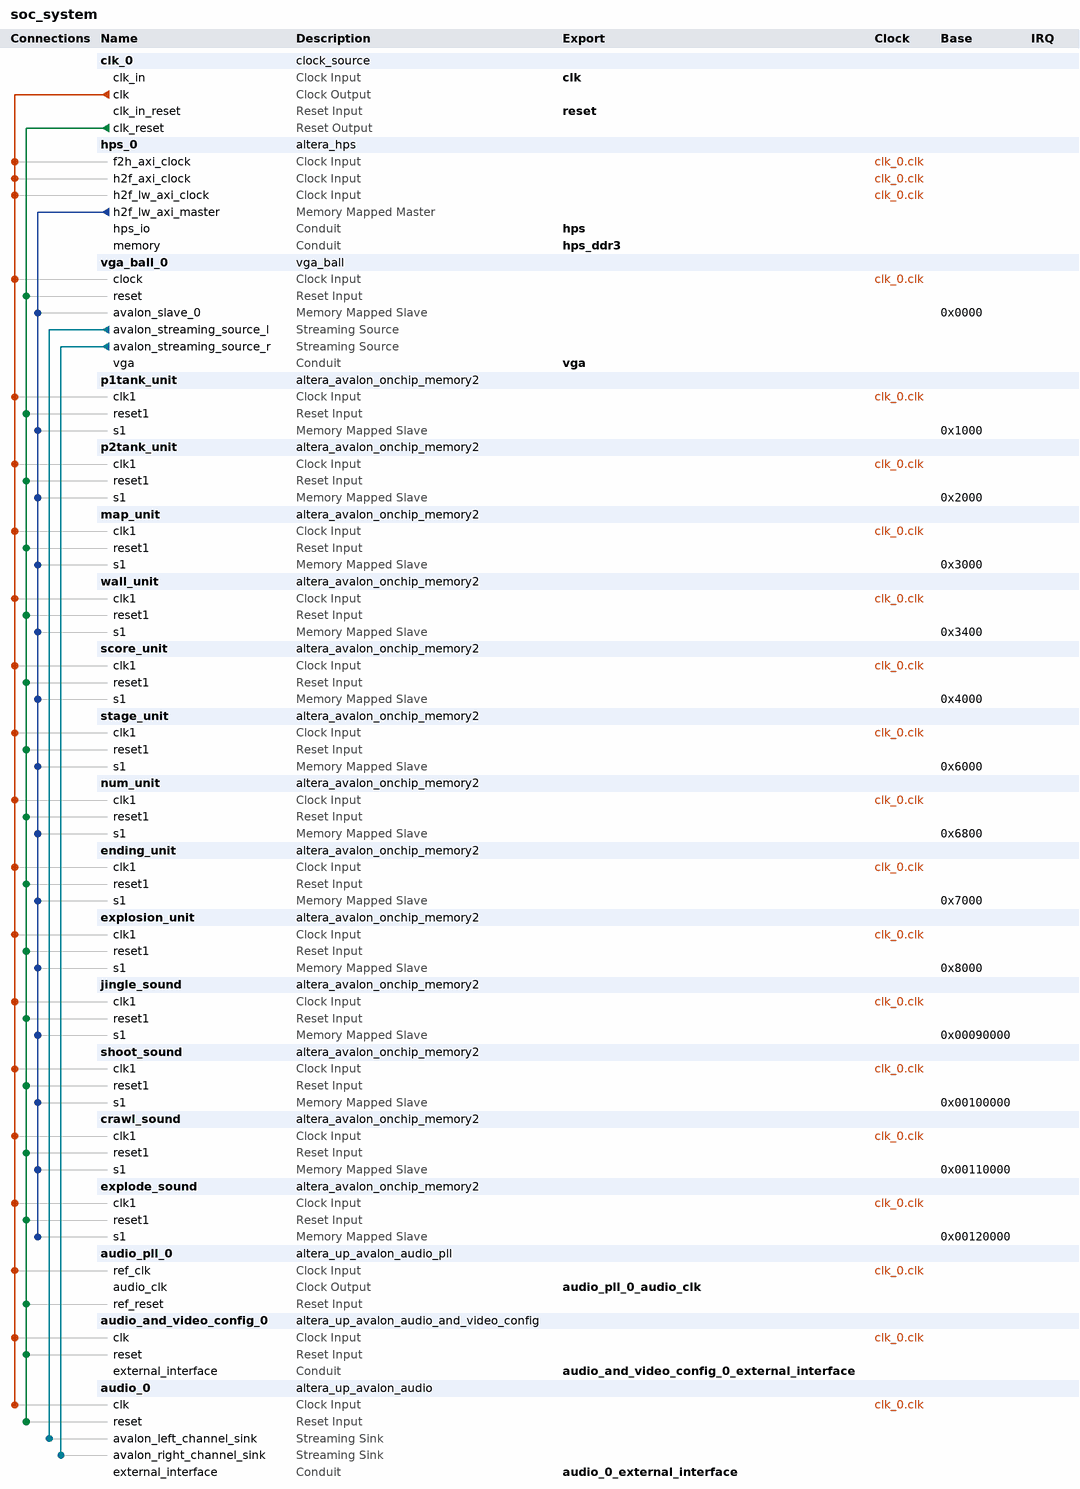
[diagram p0: system contents]
# Platform Designer (Qsys) system soc_system, Cyclone V 5CSEMA5F31C6
# Parameters at their usual value, and those the tool derives, are not listed.
package require -exact qsys 21.1
create_system soc_system
set_project_property DEVICE_FAMILY {Cyclone V}
set_project_property DEVICE 5CSEMA5F31C6

add_instance clk_0 clock_source 21.1
set_instance_parameter_value clk_0 clockFrequency 50000000

add_instance hps_0 altera_hps 21.1
set_instance_parameter_value hps_0 EMAC1_Mode RGMII
set_instance_parameter_value hps_0 EMAC1_PinMuxing {HPS I/O Set 0}
set_instance_parameter_value hps_0 F2SCLK_COLDRST_Enable false
set_instance_parameter_value hps_0 F2SCLK_DBGRST_Enable false
set_instance_parameter_value hps_0 F2SCLK_WARMRST_Enable false
set_instance_parameter_value hps_0 F2SINTERRUPT_Enable true
set_instance_parameter_value hps_0 F2S_Width 2
set_instance_parameter_value hps_0 FPGA_PERIPHERAL_OUTPUT_CLOCK_FREQ_EMAC0_GTX_CLK 125
set_instance_parameter_value hps_0 FPGA_PERIPHERAL_OUTPUT_CLOCK_FREQ_EMAC0_MD_CLK 2.5
set_instance_parameter_value hps_0 FPGA_PERIPHERAL_OUTPUT_CLOCK_FREQ_EMAC1_GTX_CLK 125
set_instance_parameter_value hps_0 FPGA_PERIPHERAL_OUTPUT_CLOCK_FREQ_EMAC1_MD_CLK 2.5
set_instance_parameter_value hps_0 HPS_PROTOCOL DDR3
set_instance_parameter_value hps_0 I2C0_Mode I2C
set_instance_parameter_value hps_0 I2C0_PinMuxing {HPS I/O Set 0}
set_instance_parameter_value hps_0 I2C1_Mode I2C
set_instance_parameter_value hps_0 I2C1_PinMuxing {HPS I/O Set 0}
set_instance_parameter_value hps_0 LWH2F_Enable true
set_instance_parameter_value hps_0 MEM_BANKADDR_WIDTH 3
set_instance_parameter_value hps_0 MEM_CLK_FREQ 400.0
set_instance_parameter_value hps_0 MEM_COL_ADDR_WIDTH 10
set_instance_parameter_value hps_0 MEM_DQ_WIDTH 32
set_instance_parameter_value hps_0 MEM_DRV_STR RZQ/7
set_instance_parameter_value hps_0 MEM_ROW_ADDR_WIDTH 15
set_instance_parameter_value hps_0 MEM_RTT_NOM RZQ/4
set_instance_parameter_value hps_0 MEM_RTT_WR RZQ/4
set_instance_parameter_value hps_0 MEM_TCL 11
set_instance_parameter_value hps_0 MEM_TFAW_NS 30.0
set_instance_parameter_value hps_0 MEM_TRAS_NS 35.0
set_instance_parameter_value hps_0 MEM_TRCD_NS 13.75
set_instance_parameter_value hps_0 MEM_TRFC_NS 260.0
set_instance_parameter_value hps_0 MEM_TRP_NS 13.75
set_instance_parameter_value hps_0 MEM_TRRD_NS 7.7
set_instance_parameter_value hps_0 MEM_VENDOR JEDEC
set_instance_parameter_value hps_0 MEM_WTCL 8
set_instance_parameter_value hps_0 QSPI_Mode N/A
set_instance_parameter_value hps_0 QSPI_PinMuxing Unused
set_instance_parameter_value hps_0 REF_CLK_FREQ 25.0
set_instance_parameter_value hps_0 S2FCLK_USER1CLK_Enable true
set_instance_parameter_value hps_0 S2FCLK_USER1CLK_FREQ 50.0
set_instance_parameter_value hps_0 S2FCLK_USER2CLK 5
set_instance_parameter_value hps_0 S2F_Width 2
set_instance_parameter_value hps_0 SDIO_Mode {4-bit Data}
set_instance_parameter_value hps_0 SDIO_PinMuxing {HPS I/O Set 0}
set_instance_parameter_value hps_0 SPIM1_Mode {Single Slave Select}
set_instance_parameter_value hps_0 SPIM1_PinMuxing {HPS I/O Set 0}
set_instance_parameter_value hps_0 STM_Enable false
set_instance_parameter_value hps_0 TIMING_BOARD_AC_SKEW 0.03
set_instance_parameter_value hps_0 TIMING_BOARD_AC_TO_CK_SKEW 0.0
set_instance_parameter_value hps_0 TIMING_BOARD_DQ_TO_DQS_SKEW 0.0
set_instance_parameter_value hps_0 TIMING_BOARD_MAX_CK_DELAY 0.03
set_instance_parameter_value hps_0 TIMING_BOARD_MAX_DQS_DELAY 0.02
set_instance_parameter_value hps_0 TIMING_BOARD_SKEW_BETWEEN_DQS 0.08
set_instance_parameter_value hps_0 TIMING_BOARD_SKEW_CKDQS_DIMM_MAX 0.16
set_instance_parameter_value hps_0 TIMING_BOARD_SKEW_CKDQS_DIMM_MIN 0.09
set_instance_parameter_value hps_0 TIMING_BOARD_SKEW_WITHIN_DQS 0.01
set_instance_parameter_value hps_0 TIMING_TDH 65
set_instance_parameter_value hps_0 TIMING_TDQSCK 255
set_instance_parameter_value hps_0 TIMING_TDQSQ 125
set_instance_parameter_value hps_0 TIMING_TDS 30
set_instance_parameter_value hps_0 TIMING_TIH 140
set_instance_parameter_value hps_0 TIMING_TIS 180
set_instance_parameter_value hps_0 TIMING_TQSH 0.4
set_instance_parameter_value hps_0 UART0_Mode {No Flow Control}
set_instance_parameter_value hps_0 UART0_PinMuxing {HPS I/O Set 0}
set_instance_parameter_value hps_0 USB1_Mode SDR
set_instance_parameter_value hps_0 USB1_PinMuxing {HPS I/O Set 0}
set_instance_parameter_value hps_0 desired_cfg_clk_mhz 50.0
set_instance_parameter_value hps_0 desired_qspi_clk_mhz 400.0

add_instance vga_ball_0 vga_ball 1.0

add_instance p1tank_unit altera_avalon_onchip_memory2 21.1
set_instance_parameter_value p1tank_unit dataWidth 8
set_instance_parameter_value p1tank_unit dualPort false
set_instance_parameter_value p1tank_unit initMemContent true
set_instance_parameter_value p1tank_unit initializationFileName /user/stud/fall21/qab2004/Desktop/TankGame/sprites/p1tank.mif
set_instance_parameter_value p1tank_unit memorySize 4096
set_instance_parameter_value p1tank_unit useNonDefaultInitFile true
set_instance_parameter_value p1tank_unit writable false

add_instance p2tank_unit altera_avalon_onchip_memory2 21.1
set_instance_parameter_value p2tank_unit dataWidth 8
set_instance_parameter_value p2tank_unit dualPort false
set_instance_parameter_value p2tank_unit initMemContent true
set_instance_parameter_value p2tank_unit initializationFileName /user/stud/fall21/qab2004/Desktop/TankGame/sprites/p2tank.mif
set_instance_parameter_value p2tank_unit memorySize 4096
set_instance_parameter_value p2tank_unit useNonDefaultInitFile true
set_instance_parameter_value p2tank_unit writable false

add_instance map_unit altera_avalon_onchip_memory2 21.1
set_instance_parameter_value map_unit dataWidth 8
set_instance_parameter_value map_unit dualPort false
set_instance_parameter_value map_unit initMemContent true
set_instance_parameter_value map_unit initializationFileName /user/stud/fall21/qab2004/Desktop/TankGame/sprites/map.mif
set_instance_parameter_value map_unit memorySize 900
set_instance_parameter_value map_unit useNonDefaultInitFile true
set_instance_parameter_value map_unit writable false

add_instance wall_unit altera_avalon_onchip_memory2 21.1
set_instance_parameter_value wall_unit dataWidth 8
set_instance_parameter_value wall_unit dualPort false
set_instance_parameter_value wall_unit initMemContent true
set_instance_parameter_value wall_unit initializationFileName /user/stud/fall21/qab2004/Desktop/TankGame/sprites/wall.mif
set_instance_parameter_value wall_unit memorySize 1024
set_instance_parameter_value wall_unit useNonDefaultInitFile true
set_instance_parameter_value wall_unit writable false

add_instance score_unit altera_avalon_onchip_memory2 21.1
set_instance_parameter_value score_unit dataWidth 8
set_instance_parameter_value score_unit dualPort false
set_instance_parameter_value score_unit initMemContent true
set_instance_parameter_value score_unit initializationFileName /user/stud/fall21/qab2004/Desktop/TankGame/sprites/score.mif
set_instance_parameter_value score_unit memorySize 5120
set_instance_parameter_value score_unit useNonDefaultInitFile true
set_instance_parameter_value score_unit writable false

add_instance stage_unit altera_avalon_onchip_memory2 21.1
set_instance_parameter_value stage_unit dataWidth 8
set_instance_parameter_value stage_unit dualPort false
set_instance_parameter_value stage_unit initMemContent true
set_instance_parameter_value stage_unit initializationFileName /user/stud/fall21/qab2004/Desktop/TankGame/sprites/stage.mif
set_instance_parameter_value stage_unit memorySize 1280
set_instance_parameter_value stage_unit useNonDefaultInitFile true
set_instance_parameter_value stage_unit writable false

add_instance num_unit altera_avalon_onchip_memory2 21.1
set_instance_parameter_value num_unit dataWidth 8
set_instance_parameter_value num_unit dualPort false
set_instance_parameter_value num_unit initMemContent true
set_instance_parameter_value num_unit initializationFileName /user/stud/fall21/qab2004/Desktop/TankGame/sprites/num.mif
set_instance_parameter_value num_unit memorySize 1280
set_instance_parameter_value num_unit useNonDefaultInitFile true
set_instance_parameter_value num_unit writable false

add_instance ending_unit altera_avalon_onchip_memory2 21.1
set_instance_parameter_value ending_unit dataWidth 8
set_instance_parameter_value ending_unit dualPort false
set_instance_parameter_value ending_unit initMemContent true
set_instance_parameter_value ending_unit initializationFileName /user/stud/fall21/qab2004/Desktop/TankGame/sprites/ending.mif
set_instance_parameter_value ending_unit memorySize 2048
set_instance_parameter_value ending_unit useNonDefaultInitFile true
set_instance_parameter_value ending_unit writable false

add_instance explosion_unit altera_avalon_onchip_memory2 21.1
set_instance_parameter_value explosion_unit dataWidth 8
set_instance_parameter_value explosion_unit dualPort false
set_instance_parameter_value explosion_unit initMemContent true
set_instance_parameter_value explosion_unit initializationFileName /user/stud/fall21/qab2004/Desktop/TankGame/sprites/explosion.mif
set_instance_parameter_value explosion_unit memorySize 3072
set_instance_parameter_value explosion_unit useNonDefaultInitFile true
set_instance_parameter_value explosion_unit writable false

add_instance jingle_sound altera_avalon_onchip_memory2 21.1
set_instance_parameter_value jingle_sound dataWidth 16
set_instance_parameter_value jingle_sound dualPort false
set_instance_parameter_value jingle_sound initMemContent true
set_instance_parameter_value jingle_sound initializationFileName /user/stud/fall21/qab2004/Desktop/TankGame/sounds/jingle.mif
set_instance_parameter_value jingle_sound memorySize 32000
set_instance_parameter_value jingle_sound useNonDefaultInitFile true
set_instance_parameter_value jingle_sound writable false

add_instance shoot_sound altera_avalon_onchip_memory2 21.1
set_instance_parameter_value shoot_sound dataWidth 16
set_instance_parameter_value shoot_sound dualPort false
set_instance_parameter_value shoot_sound initMemContent true
set_instance_parameter_value shoot_sound initializationFileName /user/stud/fall21/qab2004/Desktop/TankGame/sounds/tank_shoot.mif
set_instance_parameter_value shoot_sound memorySize 34000
set_instance_parameter_value shoot_sound useNonDefaultInitFile true
set_instance_parameter_value shoot_sound writable false

add_instance crawl_sound altera_avalon_onchip_memory2 21.1
set_instance_parameter_value crawl_sound dataWidth 16
set_instance_parameter_value crawl_sound dualPort false
set_instance_parameter_value crawl_sound initMemContent true
set_instance_parameter_value crawl_sound initializationFileName /user/stud/fall21/qab2004/Desktop/TankGame/sounds/tank_crawl.mif
set_instance_parameter_value crawl_sound memorySize 18000
set_instance_parameter_value crawl_sound useNonDefaultInitFile true
set_instance_parameter_value crawl_sound writable false

add_instance explode_sound altera_avalon_onchip_memory2 21.1
set_instance_parameter_value explode_sound dataWidth 16
set_instance_parameter_value explode_sound dualPort false
set_instance_parameter_value explode_sound initMemContent true
set_instance_parameter_value explode_sound initializationFileName /user/stud/fall21/qab2004/Desktop/TankGame/sounds/tank_explode.mif
set_instance_parameter_value explode_sound memorySize 26000
set_instance_parameter_value explode_sound useNonDefaultInitFile true
set_instance_parameter_value explode_sound writable false

add_instance audio_pll_0 altera_up_avalon_audio_pll 18.0
set_instance_parameter_value audio_pll_0 gui_refclk 50.0

add_instance audio_and_video_config_0 altera_up_avalon_audio_and_video_config 18.0
set_instance_parameter_value audio_and_video_config_0 audio_in {Microphone to ADC}
set_instance_parameter_value audio_and_video_config_0 bit_length 16
set_instance_parameter_value audio_and_video_config_0 board DE1-SoC
set_instance_parameter_value audio_and_video_config_0 line_in_bypass true
set_instance_parameter_value audio_and_video_config_0 sampling_rate {48 kHz}

add_instance audio_0 altera_up_avalon_audio 18.0
set_instance_parameter_value audio_0 audio_in true
set_instance_parameter_value audio_0 avalon_bus_type Streaming
set_instance_parameter_value audio_0 dw 16

# connections
add_connection clk_0.clk audio_0.clk clock
add_connection clk_0.clk audio_and_video_config_0.clk clock
add_connection clk_0.clk audio_pll_0.ref_clk clock
add_connection clk_0.clk crawl_sound.clk1 clock
add_connection clk_0.clk ending_unit.clk1 clock
add_connection clk_0.clk explode_sound.clk1 clock
add_connection clk_0.clk explosion_unit.clk1 clock
add_connection clk_0.clk hps_0.f2h_axi_clock clock
add_connection clk_0.clk hps_0.h2f_axi_clock clock
add_connection clk_0.clk hps_0.h2f_lw_axi_clock clock
add_connection clk_0.clk jingle_sound.clk1 clock
add_connection clk_0.clk map_unit.clk1 clock
add_connection clk_0.clk num_unit.clk1 clock
add_connection clk_0.clk p1tank_unit.clk1 clock
add_connection clk_0.clk p2tank_unit.clk1 clock
add_connection clk_0.clk score_unit.clk1 clock
add_connection clk_0.clk shoot_sound.clk1 clock
add_connection clk_0.clk stage_unit.clk1 clock
add_connection clk_0.clk vga_ball_0.clock clock
add_connection clk_0.clk wall_unit.clk1 clock
add_connection clk_0.clk_reset audio_0.reset reset
add_connection clk_0.clk_reset audio_and_video_config_0.reset reset
add_connection clk_0.clk_reset audio_pll_0.ref_reset reset
add_connection clk_0.clk_reset crawl_sound.reset1 reset
add_connection clk_0.clk_reset ending_unit.reset1 reset
add_connection clk_0.clk_reset explode_sound.reset1 reset
add_connection clk_0.clk_reset explosion_unit.reset1 reset
add_connection clk_0.clk_reset jingle_sound.reset1 reset
add_connection clk_0.clk_reset map_unit.reset1 reset
add_connection clk_0.clk_reset num_unit.reset1 reset
add_connection clk_0.clk_reset p1tank_unit.reset1 reset
add_connection clk_0.clk_reset p2tank_unit.reset1 reset
add_connection clk_0.clk_reset score_unit.reset1 reset
add_connection clk_0.clk_reset shoot_sound.reset1 reset
add_connection clk_0.clk_reset stage_unit.reset1 reset
add_connection clk_0.clk_reset vga_ball_0.reset reset
add_connection clk_0.clk_reset wall_unit.reset1 reset
add_connection hps_0.h2f_lw_axi_master crawl_sound.s1 avalon
set_connection_parameter_value hps_0.h2f_lw_axi_master/crawl_sound.s1 baseAddress 0x00110000
add_connection hps_0.h2f_lw_axi_master ending_unit.s1 avalon
set_connection_parameter_value hps_0.h2f_lw_axi_master/ending_unit.s1 baseAddress 0x7000
add_connection hps_0.h2f_lw_axi_master explode_sound.s1 avalon
set_connection_parameter_value hps_0.h2f_lw_axi_master/explode_sound.s1 baseAddress 0x00120000
add_connection hps_0.h2f_lw_axi_master explosion_unit.s1 avalon
set_connection_parameter_value hps_0.h2f_lw_axi_master/explosion_unit.s1 baseAddress 0x8000
add_connection hps_0.h2f_lw_axi_master jingle_sound.s1 avalon
set_connection_parameter_value hps_0.h2f_lw_axi_master/jingle_sound.s1 baseAddress 0x00090000
add_connection hps_0.h2f_lw_axi_master map_unit.s1 avalon
set_connection_parameter_value hps_0.h2f_lw_axi_master/map_unit.s1 baseAddress 0x3000
add_connection hps_0.h2f_lw_axi_master num_unit.s1 avalon
set_connection_parameter_value hps_0.h2f_lw_axi_master/num_unit.s1 baseAddress 0x6800
add_connection hps_0.h2f_lw_axi_master p1tank_unit.s1 avalon
set_connection_parameter_value hps_0.h2f_lw_axi_master/p1tank_unit.s1 baseAddress 0x1000
add_connection hps_0.h2f_lw_axi_master p2tank_unit.s1 avalon
set_connection_parameter_value hps_0.h2f_lw_axi_master/p2tank_unit.s1 baseAddress 0x2000
add_connection hps_0.h2f_lw_axi_master score_unit.s1 avalon
set_connection_parameter_value hps_0.h2f_lw_axi_master/score_unit.s1 baseAddress 0x4000
add_connection hps_0.h2f_lw_axi_master shoot_sound.s1 avalon
set_connection_parameter_value hps_0.h2f_lw_axi_master/shoot_sound.s1 baseAddress 0x00100000
add_connection hps_0.h2f_lw_axi_master stage_unit.s1 avalon
set_connection_parameter_value hps_0.h2f_lw_axi_master/stage_unit.s1 baseAddress 0x6000
add_connection hps_0.h2f_lw_axi_master vga_ball_0.avalon_slave_0 avalon
set_connection_parameter_value hps_0.h2f_lw_axi_master/vga_ball_0.avalon_slave_0 baseAddress 0x0000
add_connection hps_0.h2f_lw_axi_master wall_unit.s1 avalon
set_connection_parameter_value hps_0.h2f_lw_axi_master/wall_unit.s1 baseAddress 0x3400
add_connection vga_ball_0.avalon_streaming_source_l audio_0.avalon_left_channel_sink avalon_streaming
add_connection vga_ball_0.avalon_streaming_source_r audio_0.avalon_right_channel_sink avalon_streaming

# exported interfaces
add_interface audio_0_external_interface conduit end
set_interface_property audio_0_external_interface EXPORT_OF audio_0.external_interface
add_interface audio_and_video_config_0_external_interface conduit end
set_interface_property audio_and_video_config_0_external_interface EXPORT_OF audio_and_video_config_0.external_interface
add_interface audio_pll_0_audio_clk clock source
set_interface_property audio_pll_0_audio_clk EXPORT_OF audio_pll_0.audio_clk
add_interface clk clock sink
set_interface_property clk EXPORT_OF clk_0.clk_in
add_interface hps conduit end
set_interface_property hps EXPORT_OF hps_0.hps_io
add_interface hps_ddr3 conduit end
set_interface_property hps_ddr3 EXPORT_OF hps_0.memory
add_interface reset reset sink
set_interface_property reset EXPORT_OF clk_0.clk_in_reset
add_interface vga conduit end
set_interface_property vga EXPORT_OF vga_ball_0.vga

set_interconnect_requirement {$system} qsys_mm.clockCrossingAdapter HANDSHAKE
set_interconnect_requirement {$system} qsys_mm.enableEccProtection FALSE
set_interconnect_requirement {$system} qsys_mm.insertDefaultSlave FALSE
set_interconnect_requirement {$system} qsys_mm.maxAdditionalLatency 1

save_system soc_system.qsys
